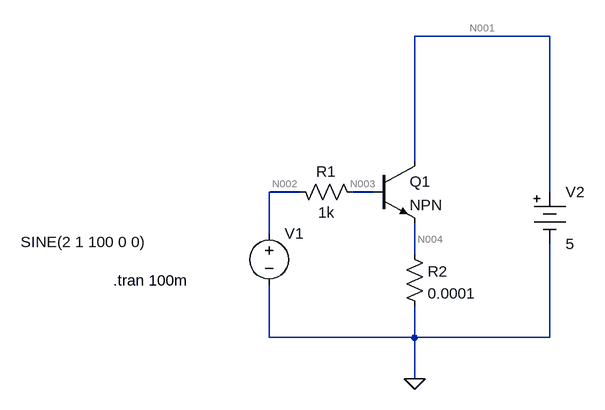
[diagram p0: schematic Yoneda-p102__Transistor_Amplify__v1_Plain_No-R3.asc]
Yoneda-p102__Transistor_Amplify__v1_Plain_No-R3.asc, the LTspice schematic file:
Version 4
SHEET 1 880 680
WIRE 496 -176 288 -176
WIRE 288 16 288 -176
WIRE 112 64 64 64
WIRE 224 64 192 64
WIRE 496 64 496 -176
WIRE 64 128 64 64
WIRE 288 160 288 112
WIRE 64 288 64 208
WIRE 288 288 288 240
WIRE 288 288 64 288
WIRE 496 288 496 144
WIRE 496 288 288 288
WIRE 288 352 288 288
FLAG 288 352 0
SYMBOL res 208 80 M270
WINDOW 0 32 56 VTop 2
WINDOW 3 0 56 VBottom 2
SYMATTR InstName R1
SYMATTR Value 1k
SYMBOL res 272 144 R0
WINDOW 0 36 42 Left 2
SYMATTR InstName R2
SYMATTR Value 0.0001
SYMBOL Misc\\battery 496 48 R0
SYMATTR InstName V2
SYMATTR Value 5
SYMBOL npn 224 16 R0
SYMATTR InstName Q1
SYMBOL voltage 64 112 R0
WINDOW 3 -382 29 Left 2
WINDOW 123 0 0 Left 2
WINDOW 39 0 0 Left 2
SYMATTR InstName V1
SYMATTR Value SINE(2 1 100 0 0)
TEXT -176 200 Left 2 !.tran 100m

The netlist it stands for:
* Yoneda-p102__Transistor_Amplify__v1_Plain_No-R3.asc
R1 N003 N002 1k
R2 N004 0 0.0001
V2 N001 0 5
Q1 N001 N003 N004 0 NPN
V1 N002 0 SINE(2 1 100 0 0)
.model NPN NPN
.model PNP PNP
.lib standard.bjt
.tran 100m
.backanno
.end

* Results of the author's LTspice run, read from the files saved beside the schematic
* Operating Point, zero values left out:
*   V(n003) = 895.9 mV
*   V(n002) = 2 V
*   V(n004) = 11.15 µV
*   V(n001) = 5 V
*   Ic(Q1) = 110.4 mA
*   Ib(Q1) = 1.104 mA
*   Ie(Q1) = -111.5 mA
*   I(R2) = 111.5 mA
*   I(R1) = -1.104 mA
*   I(V1) = -1.104 mA
*   I(V2) = -110.4 mA
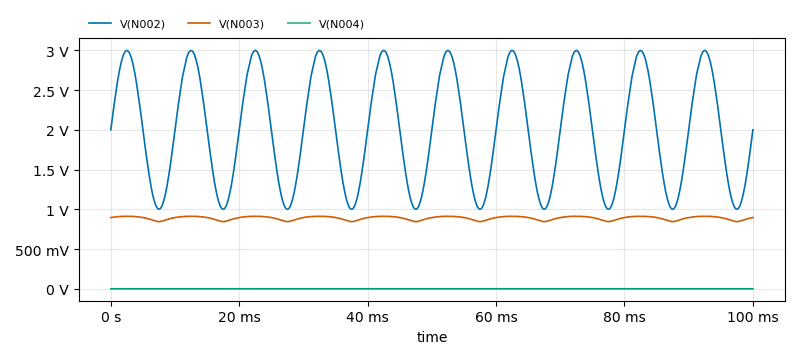
[diagram p1: Transient Analysis of Yoneda-p102__Transistor_Amplify__v1_Plain_No-R3.asc, plotted from the saved traces]
* Transient Analysis, 1 run:
*   V(N002): min 1.001 V, max 2.999 V, average 1.998 V, rms 2.121 V, last 2 V
*   V(N003): min 845.2 mV, max 912.4 mV, average 888.5 mV, rms 888.8 mV, last 895.9 mV
*   V(N004): min 1.573 µV, max 21.08 µV, average 11.21 µV, rms 13.19 µV, last 11.15 µV